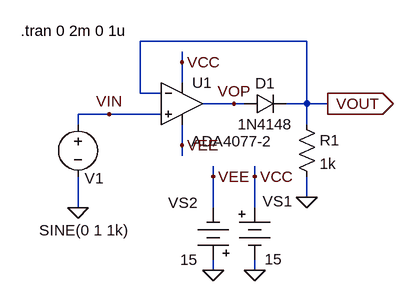
[diagram p0: schematic fig-01-03-12.asc]
fig-01-03-12.asc, the LTspice schematic file:
Version 4
SHEET 1 880 680
WIRE 400 80 144 80
WIRE 208 112 208 96
WIRE 208 144 208 112
WIRE 144 160 144 80
WIRE 176 160 144 160
WIRE 288 176 240 176
WIRE 304 176 288 176
WIRE 400 176 400 80
WIRE 400 176 368 176
WIRE 432 176 400 176
WIRE 96 192 48 192
WIRE 176 192 96 192
WIRE 48 208 48 192
WIRE 400 208 400 176
WIRE 208 240 208 208
WIRE 208 256 208 240
WIRE 256 288 256 272
WIRE 320 288 320 272
WIRE 400 320 400 288
WIRE 48 336 48 288
WIRE 256 336 256 288
WIRE 320 336 320 288
WIRE 256 432 256 416
WIRE 320 432 320 416
FLAG 48 336 0
FLAG 432 176 VOUT
IOPIN 432 176 Out
FLAG 96 192 VIN
FLAG 288 176 VOP
FLAG 256 432 0
FLAG 320 432 0
FLAG 256 288 VEE
FLAG 320 288 VCC
FLAG 208 112 VCC
FLAG 208 240 VEE
FLAG 400 320 0
SYMBOL voltage 48 192 R0
WINDOW 0 10 99 Left 2
WINDOW 3 -60 179 Left 2
WINDOW 123 0 0 Left 0
WINDOW 39 0 0 Left 0
SYMATTR InstName V1
SYMATTR Value SINE(0 1 1k)
SYMBOL diode 304 192 R270
WINDOW 0 32 32 VTop 2
WINDOW 3 0 32 VBottom 2
SYMATTR InstName D1
SYMATTR Value 1N4148
SYMBOL Misc\\battery 320 320 R0
WINDOW 0 12 6 Left 2
WINDOW 3 15 95 Left 2
SYMATTR InstName VS1
SYMATTR Value 15
SYMBOL Misc\\battery 256 432 R180
WINDOW 0 24 104 Left 2
WINDOW 3 24 16 Left 2
SYMATTR InstName VS2
SYMATTR Value 15
SYMBOL Opamps\\ADA4077-2 208 112 R0
WINDOW 3 14 122 Left 2
SYMATTR InstName U1
SYMBOL res 384 192 R0
SYMATTR InstName R1
SYMATTR Value 1k
TEXT -40 64 Left 2 !.tran 0 2m 0 1u

The netlist it stands for:
* fig-01-03-12.asc
V1 VIN 0 SINE(0 1 1k)
D1 VOP VOUT 1N4148
VS1 VCC 0 15
VS2 0 VEE 15
XU1 VIN VOUT VCC VEE VOP ADA4077-2  ; pins In+ In- V+ V- OUT
R1 VOUT 0 1k
.model D D
.lib standard.dio
.tran 0 2m 0 1u
.backanno
.end